# EAGLE design Moteino RTC Shield v2 (EAGLE 7.6.0)
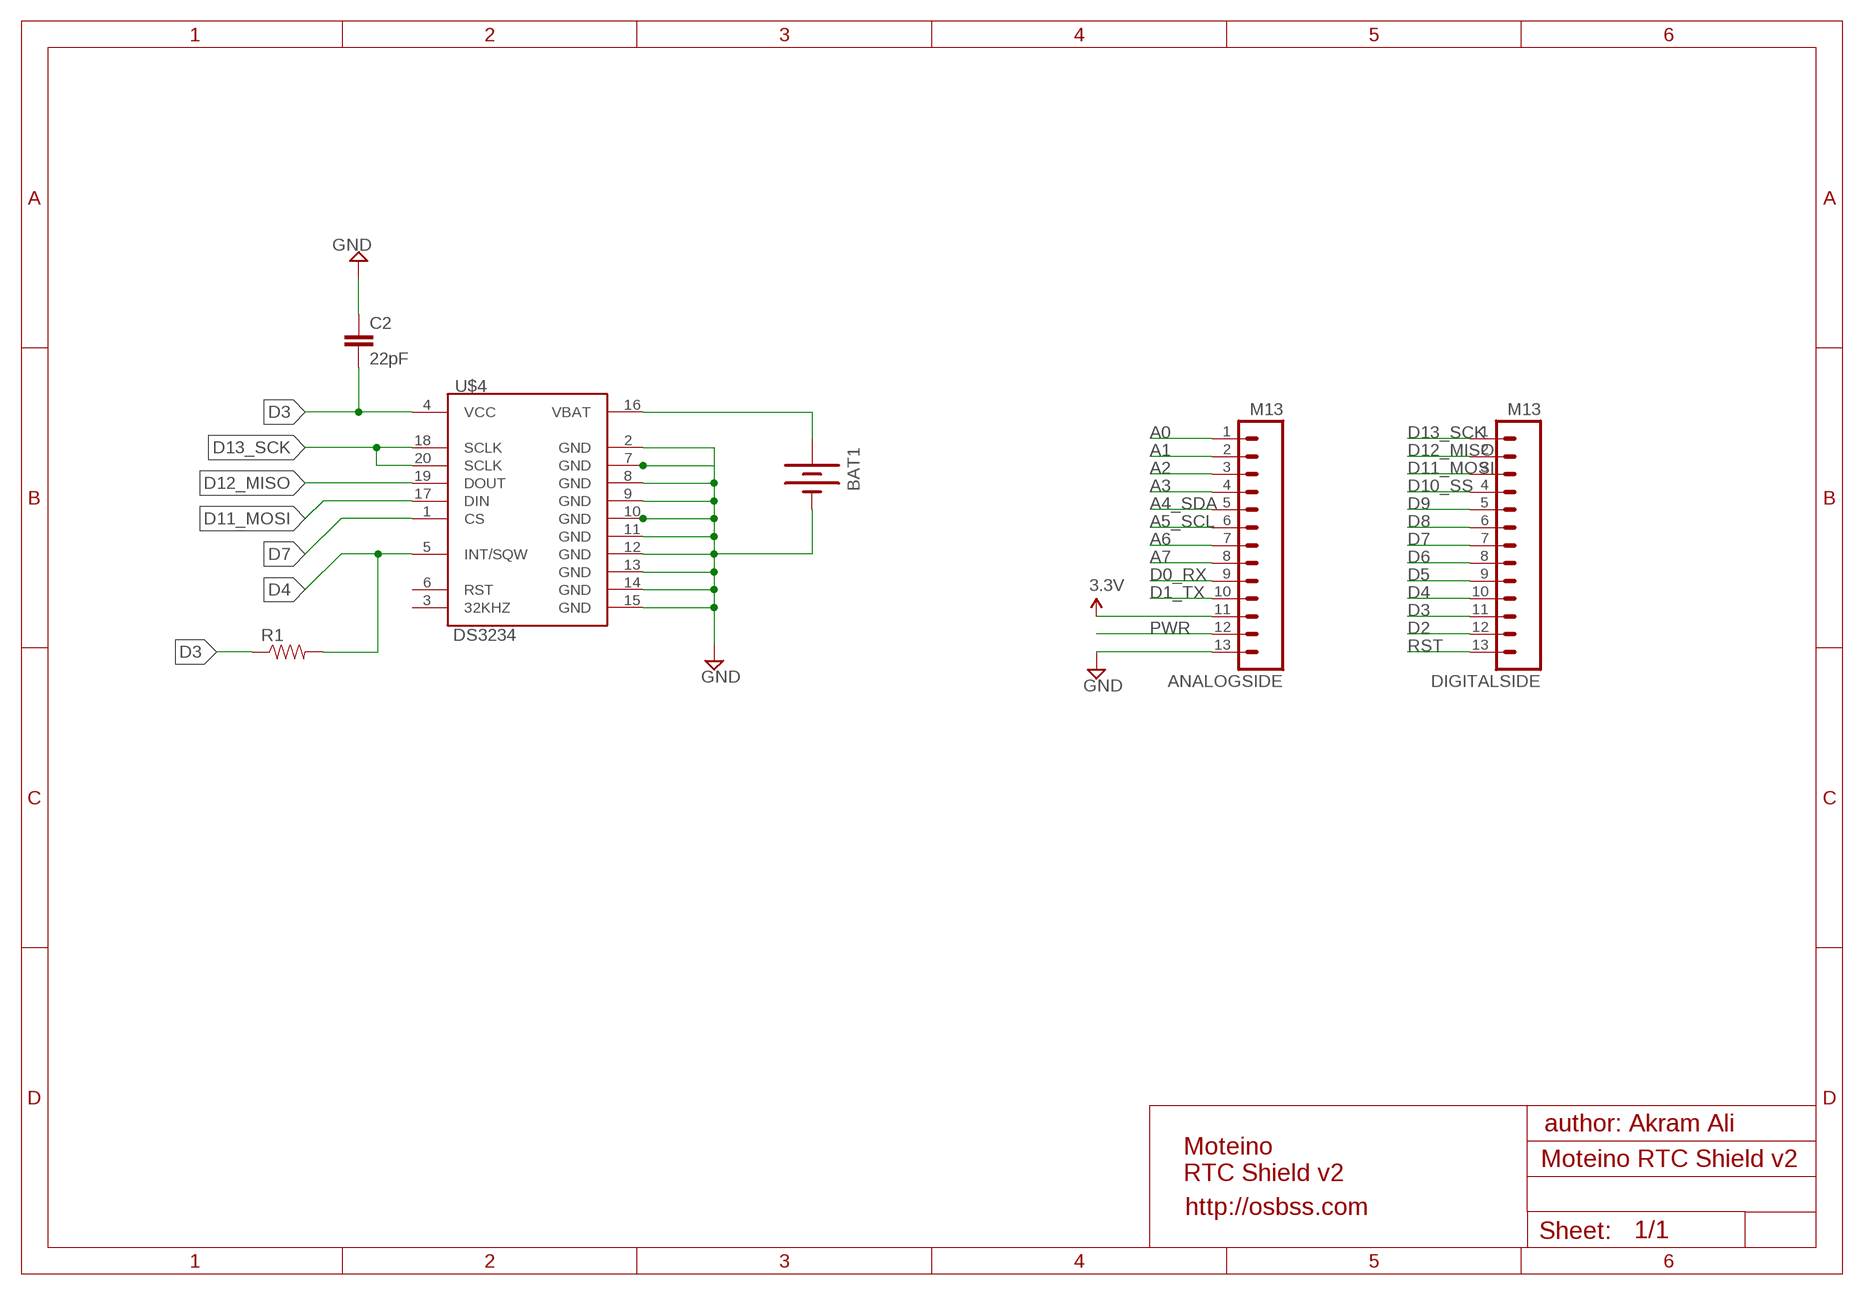
[diagram p0: schematic, sheet 1]

## Parts
ANALOGSIDE  M13  [1X13]
BAT1  BATTERY12MM  [BATTCON_12MM]
C2  22pF  CAP0805  [0805]
DIGITALSIDE  M13  [1X13]
R1  RESISTOR0805-RES  [0805]
U$4  DS3234  [DS3234]

## Nets
A0: ANALOGSIDE.1
A1: ANALOGSIDE.2
A2: ANALOGSIDE.3
A3: ANALOGSIDE.4
A4_SDA: ANALOGSIDE.5
A5_SCL: ANALOGSIDE.6
A6: ANALOGSIDE.7
A7: ANALOGSIDE.8
D0_RX: ANALOGSIDE.9
D1_TX: ANALOGSIDE.10
D2: DIGITALSIDE.12
D3: C2.2 DIGITALSIDE.11 R1.1 U$4.4(VCC)
D4: DIGITALSIDE.10 R1.2 U$4.5(INT/SQW)
D5: DIGITALSIDE.9
D6: DIGITALSIDE.8
D7: DIGITALSIDE.7 U$4.1(CS)
D8: DIGITALSIDE.6
D9: DIGITALSIDE.5
D10_SS: DIGITALSIDE.4
D11_MOSI: DIGITALSIDE.3 U$4.17(DIN)
D12_MISO: DIGITALSIDE.2 U$4.19(DOUT)
D13_SCK: DIGITALSIDE.1 U$4.18(SCLK) U$4.20(SCLK)
GND [power]: ANALOGSIDE.13 BAT1.GND(-) C2.1 U$4.2(GND) U$4.7(GND) U$4.8(GND) U$4.9(GND) U$4.10(GND) U$4.11(GND) U$4.12(GND) U$4.13(GND) U$4.14(GND) U$4.15(GND)
N$2: BAT1.PWR@1(+) U$4.16(VBAT)
PWR [power]: ANALOGSIDE.12
RST: DIGITALSIDE.13
VCC: ANALOGSIDE.11 ; supply symbol labelled 3.3V
Unconnected: U$4.3(32KHZ) U$4.6(RST)

## Notes on the sheet
- author: Akram Ali
- Moteino
  RTC Shield v2
- http://osbss.com

## Library data of the parts
ANALOGSIDE DIGITALSIDE = SparkFun-Connectors:M13: 13-pin single row .1" header
BAT1 = SparkFun-Electromechanical:BATTERY: Battery Holders Various common sizes : AA, AAA, 18650 (PRT-12895), 20mm coin cell and 12mm coin cell. 20MM_4LEGS, BATT-10373; PROD_ID: BATT-08044
C2 = SparkFun-Capacitors:CAP: Capacitor Standard 0603 ceramic capacitor, and 0.1" leaded capacitor.
R1 = SparkFun-Resistors:RESISTOR: Resistor Basic schematic elements and footprints for 0603, 1206, and PTH resistors.
U$4 = SparkFun-FreqCtrl:DS3234: SPI RTC module with battery backup and internal clock.

## Net classes
1 power: width 0.381 mm, clearance 0.254 mm

## Board
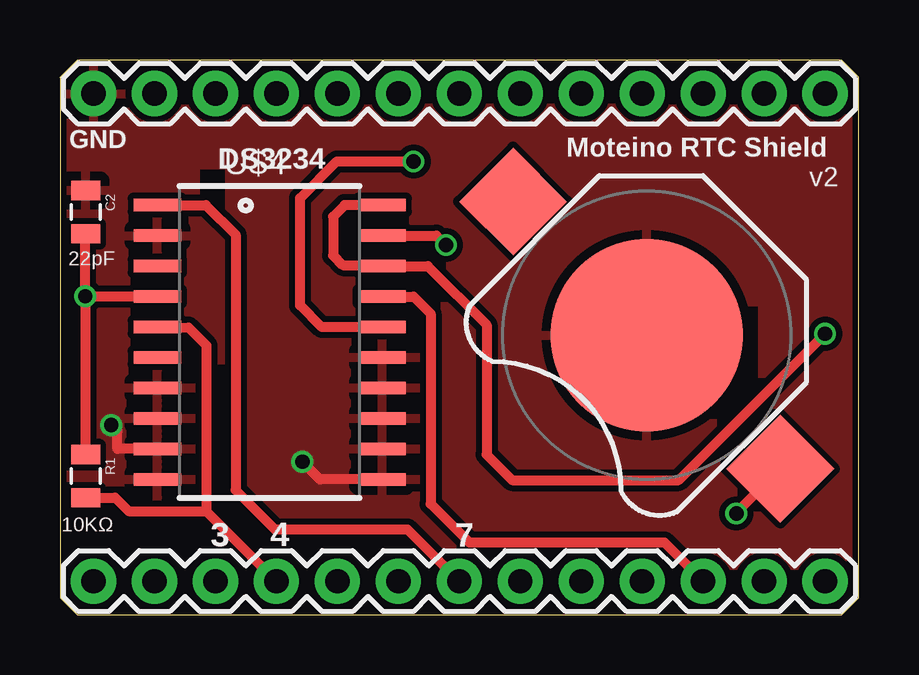
[diagram p1: board, top side]
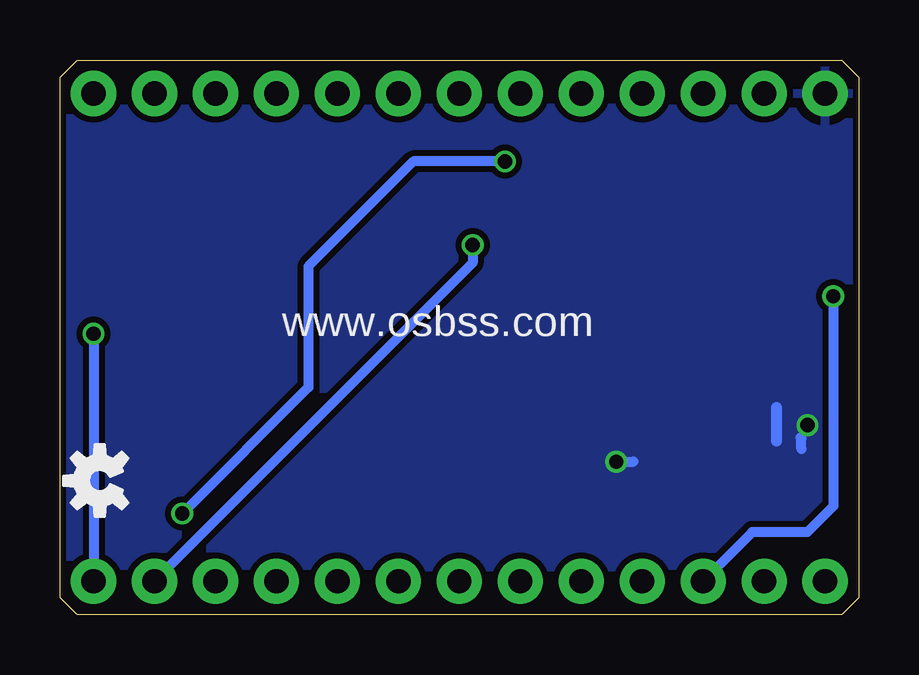
[diagram p2: board, bottom side, seen from below]

Size 33.27 x 23.11 mm. Coordinates in mm from the lower left corner, seen from the top.
Outline: 0.71,0 32.56,0 33.27,0.71 33.27,22.4 32.56,23.11 0.71,23.11 0,22.4 0,0.71 0.71,0
Copper layers (1*16): Top 0.035mm / dielectric 1.5mm / Bottom 0.035mm
Design rules "ITEADstudio_DRC *": minimum track width 6mil, minimum drill 12mil, track to track 6mil, track to pad 6mil, pad to pad 6mil, via to via 6mil, smd to smd 0mil, copper to edge 10mil, drill to drill 10mil, minimum pad ring 10mil, minimum via ring 6mil, stop-mask expansion 2mil, vias tented up to drill 100mil, thermal gap 15mil
tRestrict: area 24.3,8.9 to 29.1,12.8; area 5.8,16.9 to 6.9,18.5; area 5.2,9.7 to 6.7,10.4

### Footprints (pad centres in the part's own frame; a part is rotated, then mirrored left to right if it is on the bottom)
1X13 = drill 1.016 pad 1.88: 1 0,0; 2 2.54,0; 3 5.08,0; 4 7.62,0; 5 10.16,0; 6 12.7,0; 7 15.24,0; 8 17.78,0; 9 20.32,0; 10 22.86,0; 11 25.4,0; 12 27.94,0; 13 30.48,0
BATTCON_12MM = smd 8 x 8: GND 0,0 | smd 3.175 x 3.175: PWR@1 -7.874,0; PWR@2 7.874,0
0805 = smd 0.8 x 1.2: 1 -0.9,0; 2 0.9,0
DS3234 = smd 0.53 x 1.98: 1 -5.715,-4.685; 2 -4.445,-4.685; 3 -3.175,-4.685; 4 -1.905,-4.685; 5 -0.635,-4.685; 6 0.635,-4.685; 7 1.905,-4.685; 8 3.175,-4.685; 9 4.445,-4.685; 10 5.715,-4.685; 11 5.715,4.685; 12 4.445,4.685; 13 3.175,4.685; 14 1.905,4.685; 15 0.635,4.685; 16 -0.635,4.685; 17 -1.905,4.685; 18 -3.175,4.685; 19 -4.445,4.685; 20 -5.715,4.685

### Placement (x,y rotation side)
ANALOGSIDE  31.88,21.72 180 top
BAT1  24.45,11.65 135 top
C2  1.07,16.78 270 top
DIGITALSIDE  31.88,1.4 180 top
R1  1.07,5.78 270 top
U$3  [OSHW-LOGO-S]  31.62,5.59 90 bottom
U$4  8.74,11.35 270 top

### Tracks (layer width: path | path; a pad name or v marks a point on that pad's centre or on a via)
D3  (via drill 0.6 pad 0.61)
  Top 0.406: U$4.4 1.07,13.26 | C2.2 1.05,15.86 v1.05,13.27 1.07,13.26 | R1.1 1.07,13.26
  Bottom 0.406: v1.05,13.27 1.05,4.52 2.13,3.44 4.43,3.44 DIGITALSIDE.11
D4
  Top 0.406: U$4.5 5.36,11.96 6.1,11.23 6.1,4.32 | 6.1,4.32 DIGITALSIDE.10 | R1.2 2.3,4.88 2.86,4.32 6.1,4.32
D7
  Top 0.406: U$4.1 6.08,17.07 7.32,15.84 7.32,5.19 8.95,3.56 14.48,3.56 DIGITALSIDE.7
D11_MOSI
  Top 0.406: U$4.17 14.73,13.26 15.44,12.55 15.44,4.62 17.06,3.01 25.18,3.01 DIGITALSIDE.3
D12_MISO  (via drill 0.6 pad 0.61)
  Top 0.406: U$4.19 15.68,15.8 v16.08,15.4
  Bottom 0.406: v16.08,15.4 16.08,14.66 DIGITALSIDE.2
D13_SCK  (via drill 0.6 pad 0.61)
  Top 0.406: U$4.20 11.86,17.07 11.38,16.59 11.38,14.97 11.79,14.57 13.38,14.57 U$4.18 15.33,14.53 17.78,12.08 17.78,6.67 18.83,5.61 25.78,5.61 v31.88,11.71
  Bottom 0.406: v31.88,11.71 DIGITALSIDE.1
GND  (via drill 0.6 pad 0.61)
  Top 0.406: U$4.11 10.83,5.64 v10.1,6.38 | U$4.9 2.39,6.91 2.39,7.64 v2.13,7.9
  Bottom 0.406: v10.1,6.38 9.37,6.38 | 2.39,6.91 2.39,7.34 2.43,7.38 | v2.13,7.9 2.13,7.92
  Bottom 0.457: 3.43,8.64 3.43,7.24
  pour Bottom: -0.64,24 -0.64,-0.76 34.04,-0.76 34.04,24
  pour Top: -0.64,24 -0.64,-0.76 34.04,-0.76 34.04,24
N$2  (via drill 0.6 pad 0.61)
  Top 0.406: U$4.16 10.91,11.99 10.01,12.89 10.01,17.36 11.53,18.89 v14.73,18.89 | v28.18,4.22 28.18,4.24 BAT1.PWR@1
  Bottom 0.406: v14.73,18.89 18.55,18.89 22.92,14.52 22.92,9.47 v28.18,4.22

### Text on the board
bPlace: www.osbss.com
tDocu: REG
_tsilk: GND | DS3234 | Moteino RTC Shield | v2 | 22pF | 10KΩ | 3 | 4 | 7
_bsilk: VIN | 3.3 | 1 | 0 | A7 | A6 | A5 | A4 | A3 | A2 | A1 | A0 | GND | www.osbss.com | 2 | 3 | 4 | 5 | 6 | 7 | 8 | 9 | 10 | 11 | 12 | 13 | RST